# Altium schematic sheet IsolationBarrier.SchDoc: Isolation Barrier
size A3; DrawnBy: Jonn Dillon; DocumentNumber: 3; Revision: 01; SheetNumber: 3; SheetTotal: 10; Version: 01; Project: Battery Management System 2020; PageSetup: Record=PageOptions|CenterHorizontal=True|CenterVertical=True|PrintScale=0.97|XCorrection=1.00|YCorrection=1.00|PrintKind=0|BorderSize=5000000|LeftOffset=0|BottomOffset=0|Orientation=2|PaperLength=1000|PaperWidth=1000|Scale=100|PaperSource=7|PrintQuality=-4|MediaType=1|DitherType=10|PaperKind=A4|PrintScaleMode=1
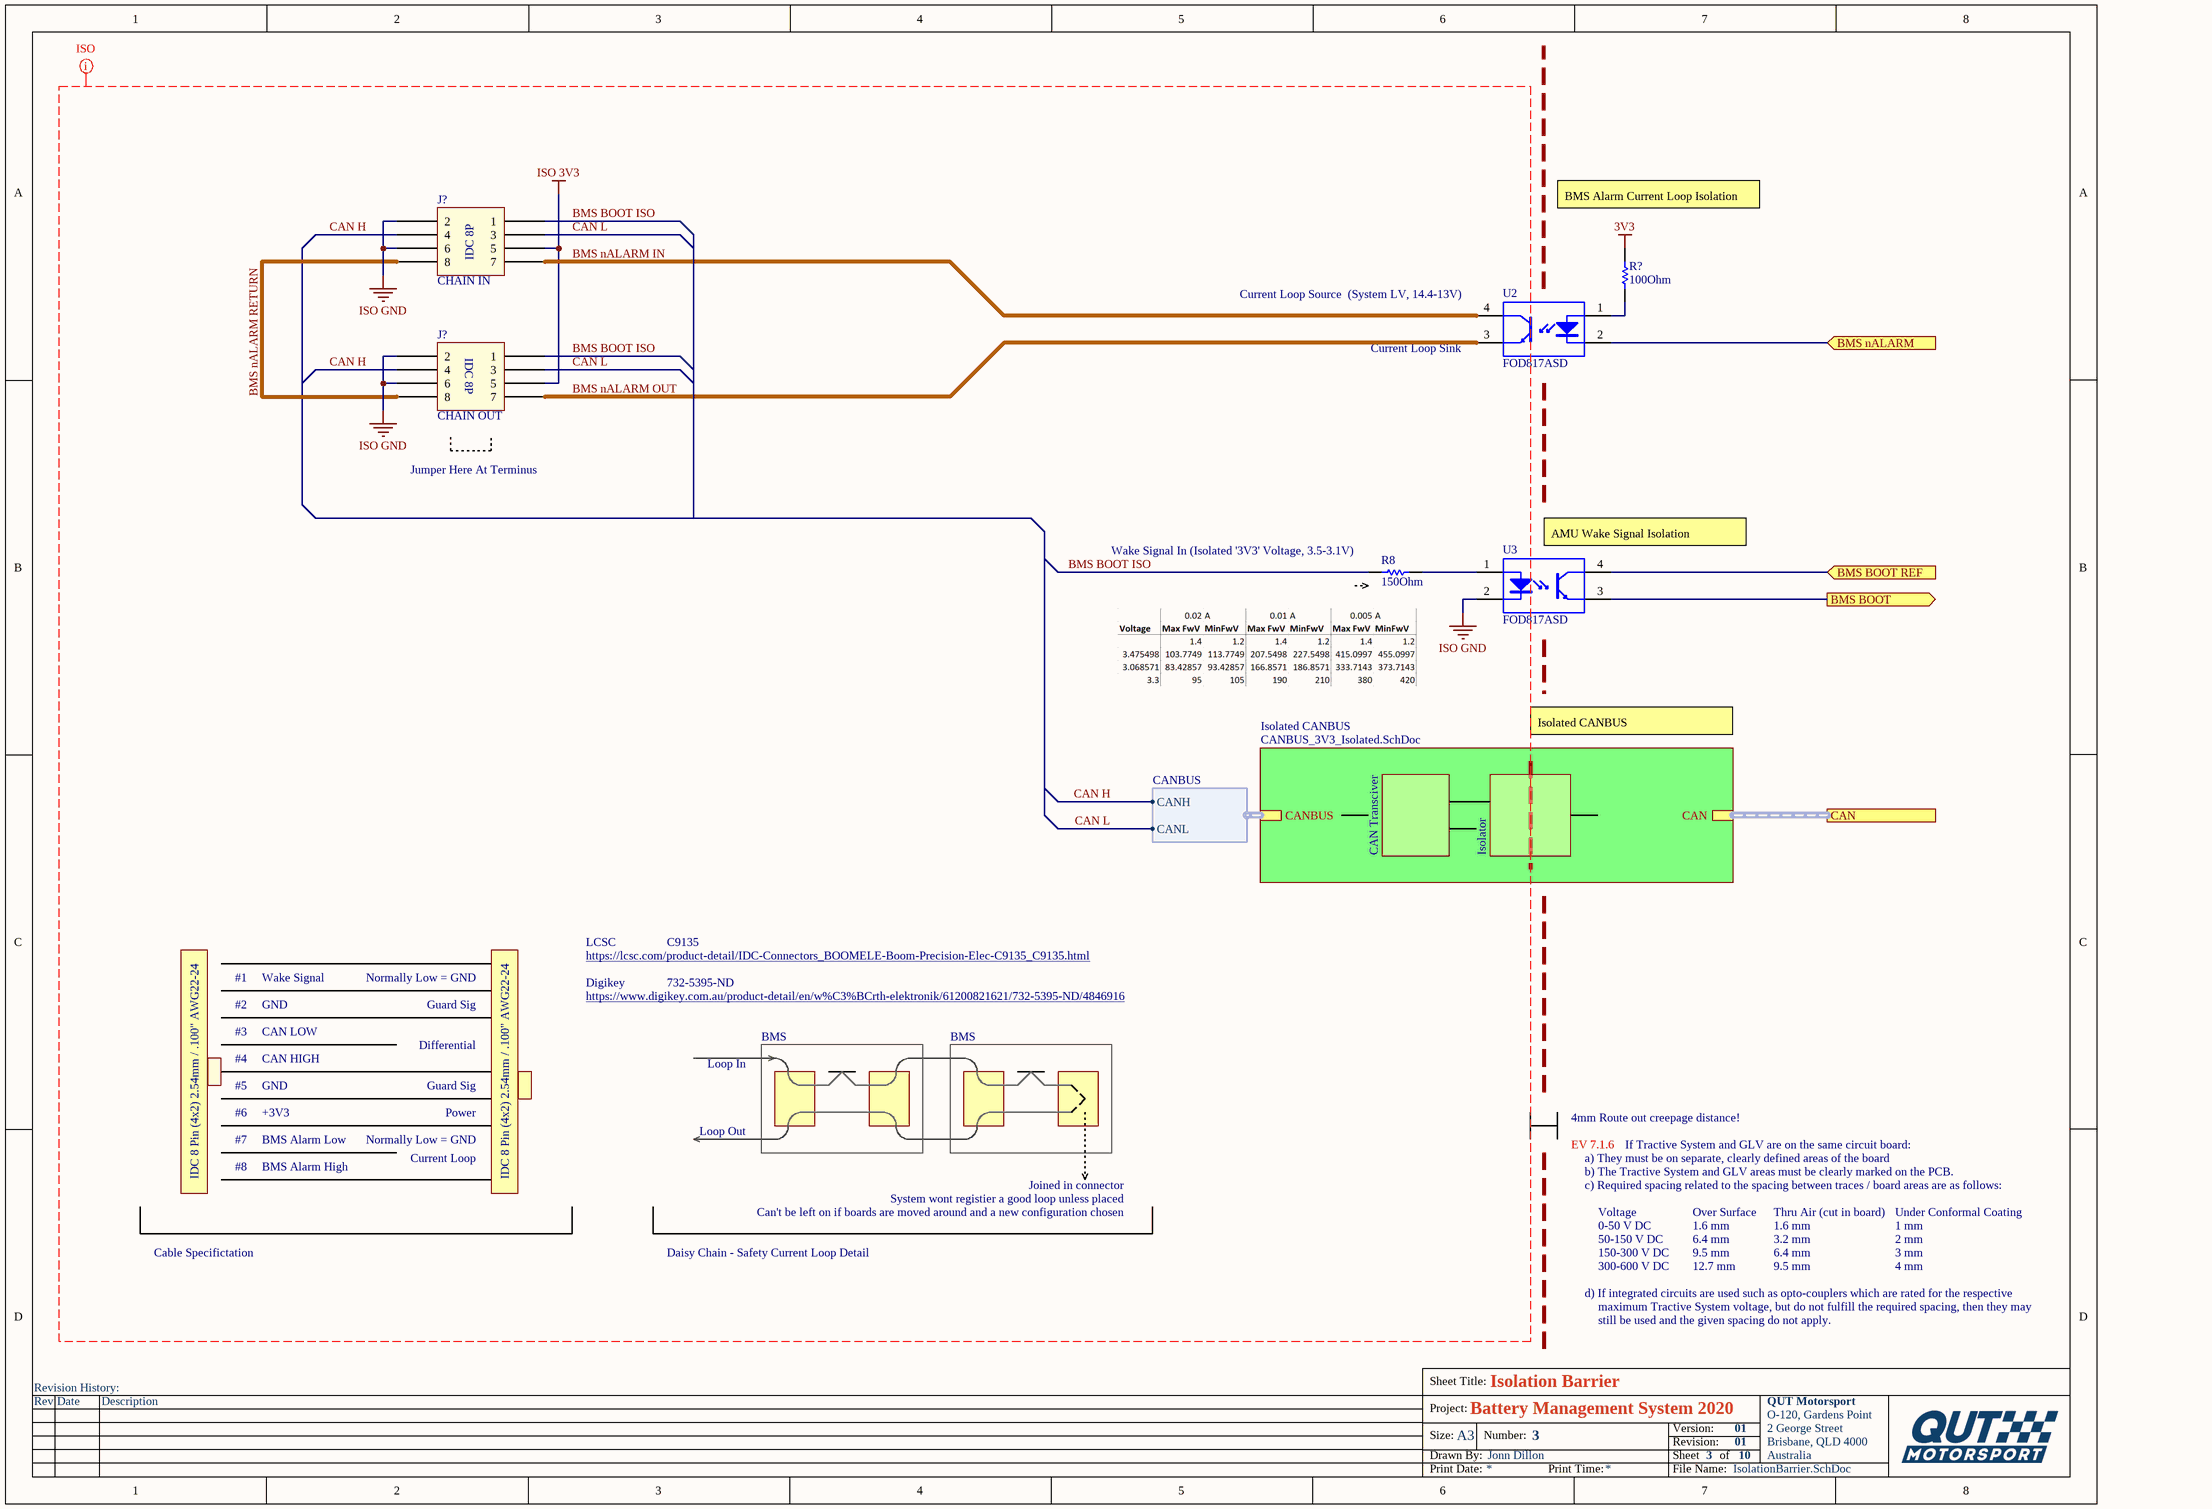
[diagram p0: IsolationBarrier.SchDoc]

## Parts
(Parts that share a designator on the sheet are numbered #1, #2 ... from top to bottom, then left to right.)
J?#1  CHAIN IN  [IDC_8P]
J?#2  CHAIN OUT  [IDC_8P]
R8  150Ohm  [RESC1608X55X30NL15T15]
R?  100Ohm  [RESC1608X55X25ML10T15]
U2  FOD817ASD  [FAIR-MDIP-4_V]
U3  FOD817ASD  [FAIR-MDIP-4_V]

## Sub-sheets
Isolated CANBUS = CANBUS_3V3_Isolated.SchDoc: CANBUS (harness CANBUS), CAN

## Ports
BMS BOOT (out), BMS BOOT REF (in), BMS nALARM (in), CAN (harness CANBUS SERIAL)

## Harnesses
CANBUS: CANH, CANL

## Nets
3V3: R?.2
ISO 3V3: J?#1.5 J?#2.5
ISO GND: J?#1.2 J?#1.6 J?#2.2 J?#2.6 U3.2(CATHODE)
BMS BOOT: U3.3(EMITTER) ; port BMS BOOT
BMS BOOT ISO: J?#1.1 J?#2.1 R8.1
BMS BOOT REF: U3.4(COLLECTOR) ; port BMS BOOT REF
BMS nALARM: U2.2(CATHODE) ; port BMS nALARM
BMS nALARM IN: J?#1.7 U2.4(COLLECTOR)
BMS nALARM OUT: J?#2.7 U2.3(EMITTER)
BMS nALARM RETURN: J?#1.8 J?#2.8
CAN H: J?#1.4 J?#2.4 ; sheet Isolated CANBUS/CANBUS.CANH
CAN L: J?#1.3 J?#2.3 ; sheet Isolated CANBUS/CANBUS.CANL
NetR8_2: R8.2 U3.1(ANODE)
NetR?_1: R?.1 U2.1(ANODE)

## Buses and harness runs
harness port CAN = sheet Isolated CANBUS/CAN

## Layout directives
mark named ISO: BMS BOOT ISO, BMS nALARM IN, BMS nALARM OUT, BMS nALARM RETURN, CAN H, CAN L, ISO 3V3, ISO GND

## Notes on the sheet
- BMS Alarm Current Loop Isolation
- (near U2) Current Loop Source  (System LV, 14.4-13V)
- (near U2) Current Loop Sink
- Jumper Here At Terminus
- (near R8) Wake Signal In (Isolated '3V3' Voltage, 3.5-3.1V)
- (near U3) AMU Wake Signal Isolation
- Isolated CANBUS
- CAN Transciver
- Isolator
- #1
- Wake Signal
- Normally Low = GND
- LCSC
- https://lcsc.com/product-detail/IDC-Connectors_BOOMELE-Boom-Precision-Elec-C9135_C9135.html
- Digikey
- 732-5395-ND
- C9135
- #2
- #3
- #4
- CAN LOW
- CAN HIGH
- GND
- Differential
- Guard Sig
- https://www.digikey.com.au/product-detail/en/w%C3%BCrth-elektronik/61200821621/732-5395-ND/4846916
- BMS
- #5
- #6
- +3V3
- Power
- Loop In
- 4mm Route out creepage distance!
- IDC 8 Pin (4x2) 2.54mm / .100" AWG22-24
- #7
- #8
- BMS Alarm High
- BMS Alarm Low
- Current Loop
- Loop Out
- Joined in connector
- EV 7.1.6
- a) They must be on separate, clearly defined areas of the board
- b) The Tractive System and GLV areas must be clearly marked on the PCB.
- c) Required spacing related to the spacing between traces / board areas are as follows:
- If Tractive System and GLV are on the same circuit board:
- Cable Specifictation
- Daisy Chain - Safety Current Loop Detail
- System wont registier a good loop unless placed
- Can't be left on if boards are moved around and a new configuration chosen
- Voltage
- 0-50 V DC
- 50-150 V DC
- 150-300 V DC
- Over Surface
- 1.6 mm
- 6.4 mm
- 9.5 mm
- Thru Air (cut in board)
- 3.2 mm
- Under Conformal Coating
- 1 mm
- 2 mm
- 3 mm
- d) If integrated circuits are used such as opto-couplers which are rated for the respective
- 300-600 V DC
- maximum Tractive System voltage, but do not fulfill the required spacing, then they may
- still be used and the given spacing do not apply.
- 12.7 mm
- 4 mm
- Revision History:
- Sheet Title:
- Rev
- Date
- Description
- Project:
- Size:
- Drawn By:
- A3
- Number:
- Revision:
- Sheet
- Version:
- of
- QUT Motorsport
- O-120, Gardens Point
- 2 George Street
- Brisbane, QLD 4000
- Australia
- Print Date:
- Print Time:
- File Name:
- (in symbol IDC_8P_2x5) IDC 8P

## Library data of the parts
J?#1 J?#2 = IDC_8P_2x5
R8 = CMP-2000-00723-1: Part Number: ERJ-3GEYJ151V; Manufacturer: Panasonic
R? = CMP-2000-05021-1: Chip Resistor, 100 Ohm, +/- 5%, 50 V, 0603 (1608 Metric), RoHS, Tape and Reel; Manufacturer: Yageo; Temperature Coefficient: 100PPM/C; Resistance: 100Ohms; Power Rating: 100mW; Voltage Rating: 50V; Manufacturer URL: http://www.yageo.com/; Product: ThickFilmResistorsGeneralPurpose; Package Description: 2-Pin Surface Mount Device, Body 1.6 x 0.8 mm; Tolerance: 5%; Termination Style: SMD/SMT; Datasheet URL: http://www.farnell.com/datasheets/443971.pdf; Operating Temperature Range: -55Cto+155C; Packaging: Reel; Case Code - in: 0603; Package Reference: 603; Series: RC; Case Code - mm: 1608; Datasheet Version: Rev. 4, 04/2009
U2 U3 = CMP-2000-06279-1: Phototransistor Optocoupler, 4 us Rise, 3 us Fall, 5000 Vrms, -55 to 110 degC, 4-Pin MDIP, RoHS, Tape and Reel; Manufacturer: Fairchild Semiconductor; Maximum Input Current: 50mA; Maximum Forward Voltage: 1.4V; Maximum Reverse Voltage: 6V; Product Width: 7mm(Max); Input Type: DC; Maximum Current Transfer Ratio: 160%; Maximum Rise Time: 18us; Typical Rise Time: 4us; Typical Forward Voltage: 1.2V; Product Length: 5.1mm(Max); Package Version: 10/2014; Maximum Collector Emitter Saturation Voltage: 200mV; Number of Channels per Chip: 1; Product Height: 4mm(Max); Maximum Power Dissipation: 200mW; Typical Fall Time: 3us; Maximum Collector Emitter Voltage: 70V; Pin_Count: 4; Minimum Current Transfer Ratio: 80%; Output Device: Transistor; Manufacturer URL: https://www.fairchildsemi.com/; Family: FOD817; Supplier_Package: PDIPSMDBlack; Datasheet URL: https://www.fairchildsemi.com/datasheets/FO/FOD817.pdf; Package Description: 4-Pin Surface Mount Device, Body 6.5 x 4.6 mm, Pitch 2.54 mm; Mounting Technology: SurfaceMount; Package Reference: MDIP 4L; Maximum Operating Temperature: 110C; Mounting: SurfaceMount; Maximum Fall Time: 18us; Package URL: https://www.fairchildsemi.com/package-drawings/N0/N04C.pdf; Product Type: TransistorandPhotovoltaicOutputPhotoCouplers; Datasheet Version: Rev. 2.8, 11/2015; Minimum Operating Temperature: -55C; Maximum Collector Current: 50mA; Packaging: TapeandReel; Minimum Isolation Voltage: 5000Vrms; Output Type: DC